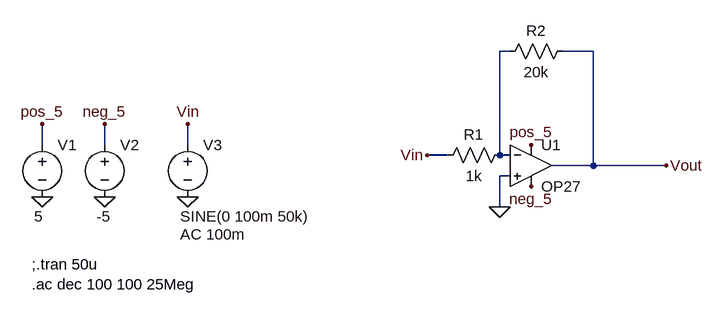
[diagram p0: schematic 1d.asc]
1d.asc, the LTspice schematic file:
Version 4
SHEET 1 1620 680
WIRE 32 -48 16 -48
WIRE 160 -48 112 -48
WIRE -688 96 -688 64
WIRE -592 96 -592 64
WIRE -464 96 -464 64
WIRE -64 112 -96 112
WIRE 16 112 16 -48
WIRE 32 112 16 112
WIRE 160 128 160 -48
WIRE 160 128 96 128
WIRE 272 128 160 128
WIRE 32 144 16 144
WIRE 16 192 16 144
FLAG -688 64 pos_5
FLAG -592 176 0
FLAG -592 64 neg_5
FLAG -688 176 0
FLAG -464 176 0
FLAG -464 64 Vin
FLAG 64 96 pos_5
FLAG 64 160 neg_5
FLAG -96 112 Vin
FLAG 272 128 Vout
FLAG 16 192 0
SYMBOL voltage -592 80 R0
WINDOW 123 0 0 Left 0
WINDOW 39 0 0 Left 0
WINDOW 3 -12 126 Left 2
SYMATTR Value -5
SYMATTR InstName V2
SYMBOL OpAmps\\OP27 64 64 R0
SYMATTR InstName U1
SYMBOL voltage -688 80 R0
WINDOW 123 0 0 Left 0
WINDOW 39 0 0 Left 0
WINDOW 3 -12 126 Left 2
SYMATTR Value 5
SYMATTR InstName V1
SYMBOL voltage -464 80 R0
WINDOW 123 -12 154 Left 2
WINDOW 39 0 0 Left 0
WINDOW 3 -12 126 Left 2
SYMATTR Value2 AC 100m
SYMATTR Value SINE(0 100m 50k)
SYMATTR InstName V3
SYMBOL res 32 96 R90
WINDOW 0 0 56 VBottom 2
WINDOW 3 32 56 VTop 2
SYMATTR InstName R1
SYMATTR Value 1k
SYMBOL res 128 -64 R90
WINDOW 0 0 56 VBottom 2
WINDOW 3 32 56 VTop 2
SYMATTR InstName R2
SYMATTR Value 20k
TEXT -704 280 Left 2 !;.tran 50u\n.ac dec 100 100 25Meg

The netlist it stands for:
* 1d.asc
V2 neg_5 0 -5
XU1 0 N001 pos_5 neg_5 Vout OP27  ; pins In+ In- V+ V- OUT
V1 pos_5 0 5
V3 Vin 0 SINE(0 100m 50k) AC 100m
R1 N001 Vin 1k
R2 Vout N001 20k
;.tran 50u
.ac dec 100 100 25Meg
.lib ADI.lib
.backanno
.end